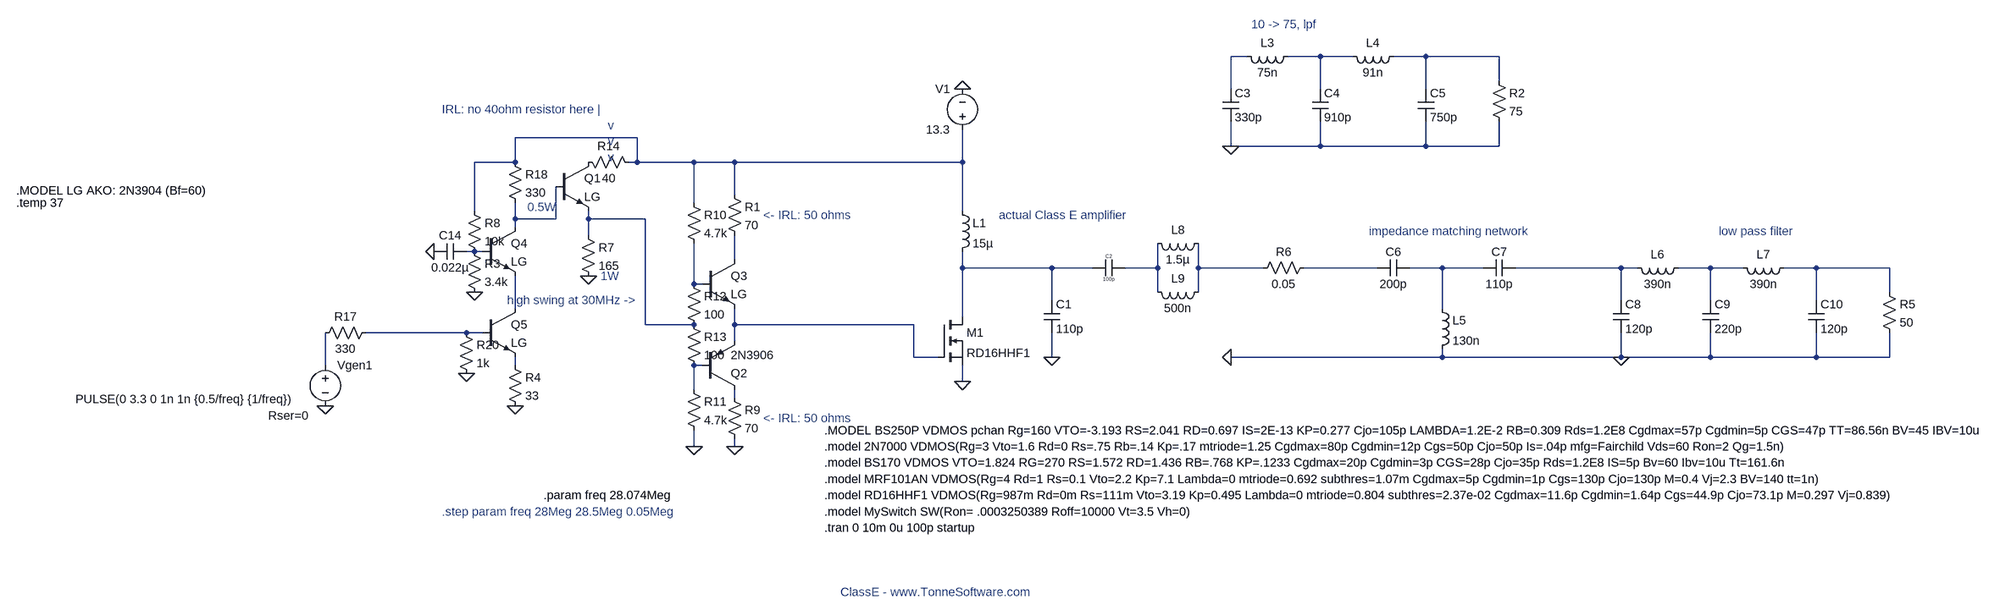
[diagram p0: schematic 28mhz_class_e_latest_cascode.asc]
28mhz_class_e_latest_cascode.asc, the LTspice schematic file:
Version 4
SHEET 1 2496 912
WIRE 832 -528 800 -528
WIRE 976 -528 912 -528
WIRE 1040 -528 976 -528
WIRE 1184 -528 1120 -528
WIRE 1328 -528 1184 -528
WIRE 1328 -480 1328 -528
WIRE 800 -464 800 -528
WIRE 976 -464 976 -528
WIRE 1184 -464 1184 -528
WIRE -368 -368 -608 -368
WIRE 800 -352 800 -400
WIRE 976 -352 976 -400
WIRE 976 -352 800 -352
WIRE 1184 -352 1184 -400
WIRE 1184 -352 976 -352
WIRE 1328 -352 1328 -400
WIRE 1328 -352 1184 -352
WIRE -608 -320 -608 -368
WIRE -608 -320 -688 -320
WIRE -368 -320 -368 -368
WIRE -368 -320 -384 -320
WIRE -256 -320 -368 -320
WIRE -176 -320 -256 -320
WIRE 272 -320 272 -384
WIRE 272 -320 -176 -320
WIRE -176 -256 -176 -320
WIRE -256 -240 -256 -320
WIRE -688 -224 -688 -320
WIRE 272 -224 272 -320
WIRE -608 -208 -608 -240
WIRE -528 -208 -528 -272
WIRE -528 -208 -608 -208
WIRE -464 -208 -464 -224
WIRE -352 -208 -464 -208
WIRE -608 -192 -608 -208
WIRE -464 -176 -464 -208
WIRE -688 -144 -704 -144
WIRE -672 -144 -688 -144
WIRE -176 -128 -176 -176
WIRE 272 -112 272 -144
WIRE 448 -112 272 -112
WIRE 528 -112 448 -112
WIRE 656 -112 656 -160
WIRE 656 -112 592 -112
WIRE 736 -112 736 -160
WIRE 864 -112 736 -112
WIRE 1088 -112 944 -112
WIRE 1216 -112 1152 -112
WIRE 1296 -112 1216 -112
WIRE 1568 -112 1360 -112
WIRE 1600 -112 1568 -112
WIRE 1744 -112 1680 -112
WIRE 1808 -112 1744 -112
WIRE 1952 -112 1888 -112
WIRE 2096 -112 1952 -112
WIRE -256 -80 -256 -160
WIRE -240 -80 -256 -80
WIRE 656 -64 656 -112
WIRE 736 -64 736 -112
WIRE 2096 -64 2096 -112
WIRE 448 -48 448 -112
WIRE 1568 -48 1568 -112
WIRE 1744 -48 1744 -112
WIRE 1952 -48 1952 -112
WIRE -608 -32 -608 -96
WIRE 1216 -32 1216 -112
WIRE 272 -16 272 -112
WIRE -352 0 -352 -208
WIRE -256 0 -352 0
WIRE -176 0 -176 -32
WIRE 176 0 -176 0
WIRE -704 16 -960 16
WIRE -672 16 -704 16
WIRE -176 32 -176 0
WIRE 176 64 176 0
WIRE 224 64 176 64
WIRE 448 64 448 16
WIRE 1216 64 1216 48
WIRE 1216 64 800 64
WIRE 1568 64 1568 16
WIRE 1568 64 1216 64
WIRE 1744 64 1744 16
WIRE 1744 64 1568 64
WIRE 1952 64 1952 16
WIRE 1952 64 1744 64
WIRE 2096 64 2096 16
WIRE 2096 64 1952 64
WIRE -1040 80 -1040 16
WIRE -608 80 -608 64
WIRE -240 80 -256 80
WIRE 272 112 272 80
WIRE -256 128 -256 80
WIRE -176 144 -176 128
WIRE -256 240 -256 208
WIRE -176 240 -176 224
FLAG 272 112 0
FLAG 448 64 0
FLAG 800 64 0
FLAG 800 -352 0
FLAG 1568 64 0
FLAG 272 -464 0
FLAG -1040 160 0
FLAG -704 96 0
FLAG -768 -144 0
FLAG -608 160 0
FLAG -464 -96 0
FLAG -688 -64 0
FLAG -176 240 0
FLAG -256 240 0
SYMBOL ind 256 -240 R0
SYMATTR InstName L1
SYMATTR Value 15µ
SYMBOL cap 432 -48 R0
SYMATTR InstName C1
SYMATTR Value 110p
SYMBOL cap 592 -128 R90
WINDOW 0 0 32 VBottom 0
WINDOW 3 32 32 VTop 0
SYMATTR InstName C2
SYMATTR Value 100p
SYMBOL nmos 224 -16 R0
SYMATTR InstName M1
SYMATTR Value RD16HHF1
SYMBOL ind 928 -544 R90
WINDOW 0 5 56 VBottom 2
WINDOW 3 32 56 VTop 2
SYMATTR InstName L3
SYMATTR Value 75n
SYMBOL ind 1136 -544 R90
WINDOW 0 5 56 VBottom 2
WINDOW 3 32 56 VTop 2
SYMATTR InstName L4
SYMATTR Value 91n
SYMBOL cap 784 -464 R0
SYMATTR InstName C3
SYMATTR Value 330p
SYMBOL cap 960 -464 R0
SYMATTR InstName C4
SYMATTR Value 910p
SYMBOL cap 1168 -464 R0
SYMATTR InstName C5
SYMATTR Value 750p
SYMBOL res 1312 -496 R0
SYMATTR InstName R2
SYMATTR Value 75
SYMBOL cap 1152 -128 R90
WINDOW 0 0 32 VBottom 2
WINDOW 3 32 32 VTop 2
SYMATTR InstName C6
SYMATTR Value 200p
SYMBOL ind 1200 -48 R0
SYMATTR InstName L5
SYMATTR Value 130n
SYMBOL cap 1360 -128 R90
WINDOW 0 0 32 VBottom 2
WINDOW 3 32 32 VTop 2
SYMATTR InstName C7
SYMATTR Value 110p
SYMBOL ind 1696 -128 R90
WINDOW 0 5 56 VBottom 2
WINDOW 3 32 56 VTop 2
SYMATTR InstName L6
SYMATTR Value 390n
SYMBOL ind 1904 -128 R90
WINDOW 0 5 56 VBottom 2
WINDOW 3 32 56 VTop 2
SYMATTR InstName L7
SYMATTR Value 390n
SYMBOL cap 1552 -48 R0
SYMATTR InstName C8
SYMATTR Value 120p
SYMBOL cap 1728 -48 R0
SYMATTR InstName C9
SYMATTR Value 220p
SYMBOL cap 1936 -48 R0
SYMATTR InstName C10
SYMATTR Value 120p
SYMBOL res 2080 -80 R0
SYMATTR InstName R5
SYMATTR Value 50
SYMBOL ind 752 -176 R90
WINDOW 0 5 56 VBottom 2
WINDOW 3 32 56 VTop 2
SYMATTR InstName L8
SYMATTR Value 1.5µ
SYMBOL ind 752 -80 R90
WINDOW 0 5 56 VBottom 2
WINDOW 3 32 56 VTop 2
SYMATTR InstName L9
SYMATTR Value 500n
SYMBOL res 960 -128 R90
WINDOW 0 0 56 VBottom 2
WINDOW 3 32 56 VTop 2
SYMATTR InstName R6
SYMATTR Value 0.05
SYMBOL voltage 272 -368 R180
WINDOW 0 24 96 Left 2
WINDOW 3 24 16 Left 2
WINDOW 123 0 0 Left 0
WINDOW 39 0 0 Left 0
SYMATTR InstName V1
SYMATTR Value 13.3
SYMBOL voltage -1040 64 R0
WINDOW 123 24 132 Left 0
WINDOW 39 -112 115 Left 2
WINDOW 3 -491 83 Left 2
SYMATTR SpiceLine Rser=0
SYMATTR Value PULSE(0 3.3 0 1n 1n {0.5/freq} {1/freq})
SYMATTR InstName Vgen1
SYMBOL res -944 0 R90
WINDOW 0 0 56 VBottom 2
WINDOW 3 32 56 VTop 2
SYMATTR InstName R17
SYMATTR Value 330
SYMBOL npn -672 -192 R0
SYMATTR InstName Q4
SYMATTR Value LG
SYMBOL npn -672 -32 R0
SYMATTR InstName Q5
SYMATTR Value LG
SYMBOL res -624 -336 R0
SYMATTR InstName R18
SYMATTR Value 330
SYMATTR SpiceLine pwr=0.5
SYMBOL res -720 0 R0
SYMATTR InstName R20
SYMATTR Value 1k
SYMBOL cap -704 -160 R90
WINDOW 0 0 32 VBottom 2
WINDOW 3 32 32 VTop 2
SYMATTR InstName C14
SYMATTR Value 0.022µ
SYMBOL res -624 64 R0
SYMATTR InstName R4
SYMATTR Value 33
SYMBOL npn -528 -320 R0
SYMATTR InstName Q1
SYMATTR Value LG
SYMBOL res -480 -192 R0
SYMATTR InstName R7
SYMATTR Value 165
SYMATTR SpiceLine pwr=0.5
SYMBOL res -704 -160 R0
SYMATTR InstName R3
SYMATTR Value 3.4k
SYMBOL res -704 -240 R0
SYMATTR InstName R8
SYMATTR Value 10k
SYMBOL pnp -240 128 M180
SYMATTR InstName Q2
SYMATTR Value 2N3906
SYMBOL npn -240 -128 R0
SYMATTR InstName Q3
SYMATTR Value LG
SYMBOL res -192 -272 R0
SYMATTR InstName R1
SYMATTR Value 70
SYMBOL res -192 128 R0
SYMATTR InstName R9
SYMATTR Value 70
SYMBOL res -272 -256 R0
SYMATTR InstName R10
SYMATTR Value 4.7k
SYMBOL res -272 112 R0
SYMATTR InstName R11
SYMATTR Value 4.7k
SYMBOL res -272 -96 R0
SYMATTR InstName R12
SYMATTR Value 100
SYMBOL res -272 -16 R0
SYMATTR InstName R13
SYMATTR Value 100
SYMBOL res -480 -336 M90
WINDOW 0 0 56 VBottom 2
WINDOW 3 32 56 VTop 2
SYMATTR InstName R14
SYMATTR Value 40
TEXT 0 368 Left 2 !.model MySwitch SW(Ron= .0003250389 Roff=10000 Vt=3.5 Vh=0)
TEXT 0 400 Left 2 !.tran 0 10m 0u 100p startup
TEXT 32 528 Left 2 ;ClassE - www.TonneSoftware.com
TEXT 0 336 Left 2 !.model RD16HHF1 VDMOS(Rg=987m Rd=0m Rs=111m Vto=3.19 Kp=0.495 Lambda=0 mtriode=0.804 subthres=2.37e-02 Cgdmax=11.6p Cgdmin=1.64p Cgs=44.9p Cjo=73.1p M=0.297 Vj=0.839)
TEXT 344 -216 Left 2 ;actual Class E amplifier
TEXT -552 336 Left 2 !.param freq 28.074Meg
TEXT -752 368 Left 2 ;.step param freq 28Meg 28.5Meg 0.05Meg
TEXT 840 -592 Left 2 ;10 -> 75, lpf
TEXT 1072 -184 Left 2 ;impedance matching network
TEXT 1760 -184 Left 2 ;low pass filter
TEXT 0 304 Left 2 !.model MRF101AN VDMOS(Rg=4 Rd=1 Rs=0.1 Vto=2.2 Kp=7.1 Lambda=0 mtriode=0.692 subthres=1.07m Cgdmax=5p Cgdmin=1p Cgs=130p Cjo=130p M=0.4 Vj=2.3 BV=140 tt=1n)
TEXT 0 272 Left 2 !.model BS170 VDMOS VTO=1.824 RG=270 RS=1.572 RD=1.436 RB=.768 KP=.1233 Cgdmax=20p Cgdmin=3p CGS=28p Cjo=35p Rds=1.2E8 IS=5p Bv=60 Ibv=10u Tt=161.6n
TEXT 0 240 Left 2 !.model 2N7000 VDMOS(Rg=3 Vto=1.6 Rd=0 Rs=.75 Rb=.14 Kp=.17 mtriode=1.25 Cgdmax=80p Cgdmin=12p Cgs=50p Cjo=50p Is=.04p mfg=Fairchild Vds=60 Ron=2 Qg=1.5n)
TEXT 0 208 Left 2 !.MODEL BS250P VDMOS pchan Rg=160 VTO=-3.193 RS=2.041 RD=0.697 IS=2E-13 KP=0.277 Cjo=105p LAMBDA=1.2E-2 RB=0.309 Rds=1.2E8 Cgdmax=57p Cgdmin=5p CGS=47p TT=86.56n BV=45 IBV=10u
TEXT -1648 -264 Left 2 !.MODEL LG AKO: 2N3904 (Bf=60)
TEXT -1648 -240 Left 2 !.temp 37
TEXT -440 -96 Left 2 ;1W
TEXT -584 -232 Left 2 ;0.5W
TEXT -624 -48 Left 2 ;high swing at 30MHz ->
TEXT -120 -216 Left 2 ;<- IRL: 50 ohms
TEXT -120 184 Left 2 ;<- IRL: 50 ohms
TEXT -752 -424 Left 2 ;IRL: no 40ohm resistor here |\n                                                 v\n                                                 v\n                                                 v

The netlist it stands for:
* 28mhz_class_e_latest_cascode.asc
L1 N004 N009 15µ
C1 N009 0 110p
C2 N010 N009 100p
M1 N009 N019 0 0 RD16HHF1
L3 N002 N001 75n
L4 N003 N002 91n
C3 N001 0 330p
C4 N002 0 910p
C5 N003 0 750p
R2 N003 0 75
C6 N013 N012 200p
L5 N013 0 130n
C7 N014 N013 110p
L6 N015 N014 390n
L7 N016 N015 390n
C8 N014 0 120p
C9 N015 0 220p
C10 N016 0 120p
R5 N016 0 50
L8 N011 N010 1.5µ
L9 N011 N010 500n
R6 N012 N011 0.05
V1 N004 0 13.3
Vgen1 N021 0 PULSE(0 3.3 0 1n 1n {0.5/freq} {1/freq}) Rser=0
R17 N020 N021 330
Q4 N005 N007 N018 0 LG
Q5 N018 N020 N022 0 LG
R18 N004 N005 330 pwr=0.5
R20 N020 0 1k
C14 N007 0 0.022µ
R4 N022 0 33
Q1 P001 N005 N006 0 LG
R7 N006 0 165 pwr=0.5
R3 N007 0 3.4k
R8 N004 N007 10k
Q2 N024 N023 N019 0 2N3906
Q3 N008 N017 N019 0 LG
R1 N004 N008 70
R9 N024 0 70
R10 N004 N017 4.7k
R11 N023 0 4.7k
R12 N017 N006 100
R13 N006 N023 100
R14 P001 N004 40
.model NPN NPN
.model PNP PNP
.lib standard.bjt
.model NMOS NMOS
.model PMOS PMOS
.lib standard.mos
.model MySwitch SW(Ron= .0003250389 Roff=10000 Vt=3.5 Vh=0)
.tran 0 10m 0u 100p startup
* ClassE - www.TonneSoftware.com
.model RD16HHF1 VDMOS(Rg=987m Rd=0m Rs=111m Vto=3.19 Kp=0.495 Lambda=0 mtriode=0.804 subthres=2.37e-02 Cgdmax=11.6p Cgdmin=1.64p Cgs=44.9p Cjo=73.1p M=0.297 Vj=0.839)
* actual Class E amplifier
.param freq 28.074Meg
* .step param freq 28Meg 28.5Meg 0.05Meg
* 10 -> 75, lpf
* impedance matching network
* low pass filter
.model MRF101AN VDMOS(Rg=4 Rd=1 Rs=0.1 Vto=2.2 Kp=7.1 Lambda=0 mtriode=0.692 subthres=1.07m Cgdmax=5p Cgdmin=1p Cgs=130p Cjo=130p M=0.4 Vj=2.3 BV=140 tt=1n)
.model BS170 VDMOS VTO=1.824 RG=270 RS=1.572 RD=1.436 RB=.768 KP=.1233 Cgdmax=20p Cgdmin=3p CGS=28p Cjo=35p Rds=1.2E8 IS=5p Bv=60 Ibv=10u Tt=161.6n
.model 2N7000 VDMOS(Rg=3 Vto=1.6 Rd=0 Rs=.75 Rb=.14 Kp=.17 mtriode=1.25 Cgdmax=80p Cgdmin=12p Cgs=50p Cjo=50p Is=.04p mfg=Fairchild Vds=60 Ron=2 Qg=1.5n)
.MODEL BS250P VDMOS pchan Rg=160 VTO=-3.193 RS=2.041 RD=0.697 IS=2E-13 KP=0.277 Cjo=105p LAMBDA=1.2E-2 RB=0.309 Rds=1.2E8 Cgdmax=57p Cgdmin=5p CGS=47p TT=86.56n BV=45 IBV=10u
.MODEL LG AKO: 2N3904 (Bf=60)
.temp 37
* 1W
* 0.5W
* high swing at 30MHz ->
* <- IRL: 50 ohms
* <- IRL: 50 ohms
* IRL: no 40ohm resistor here |
*                                                  v
*                                                  v
*                                                  v
.backanno
.end